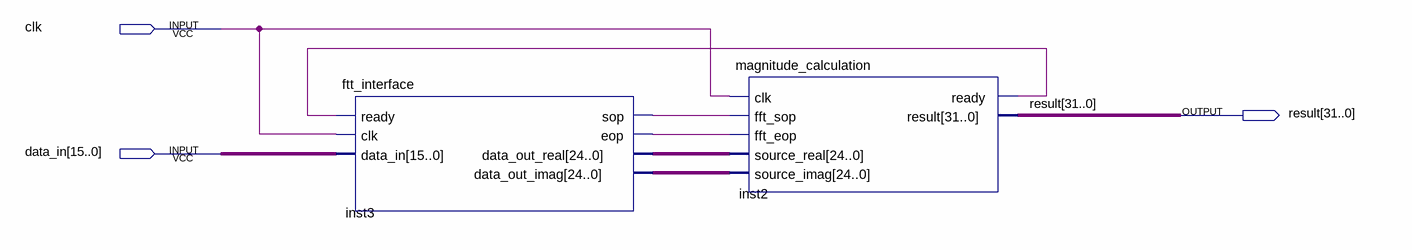
[diagram p0: schematic sheet]
// Quartus schematic frequency_finder.bdf as structural Verilog: 2 symbols, 3 pins
module frequency_finder (
  input  clk,
  input  [15:0] data_in,
  output [31:0] result
);

  wire inst2_ready, inst3_eop, inst3_sop;
  wire [24:0] inst3_data_out_imag, inst3_data_out_real;

  ftt_interface inst3 (
    .ready(inst2_ready), .clk(clk), .data_in(data_in), .sop(inst3_sop), .eop(inst3_eop),
    .data_out_real(inst3_data_out_real), .data_out_imag(inst3_data_out_imag));
  magnitude_calculation inst2 (
    .clk(clk), .fft_sop(inst3_sop), .fft_eop(inst3_eop), .source_real(inst3_data_out_real),
    .source_imag(inst3_data_out_imag), .ready(inst2_ready), .result(result));
endmodule
